# Altium schematic sheet ArduinoUno.SchDoc
size 209 x 148 mm; Organization: LieBtrau; DocumentNumber: 2; SheetNumber: 2; SheetTotal: 2
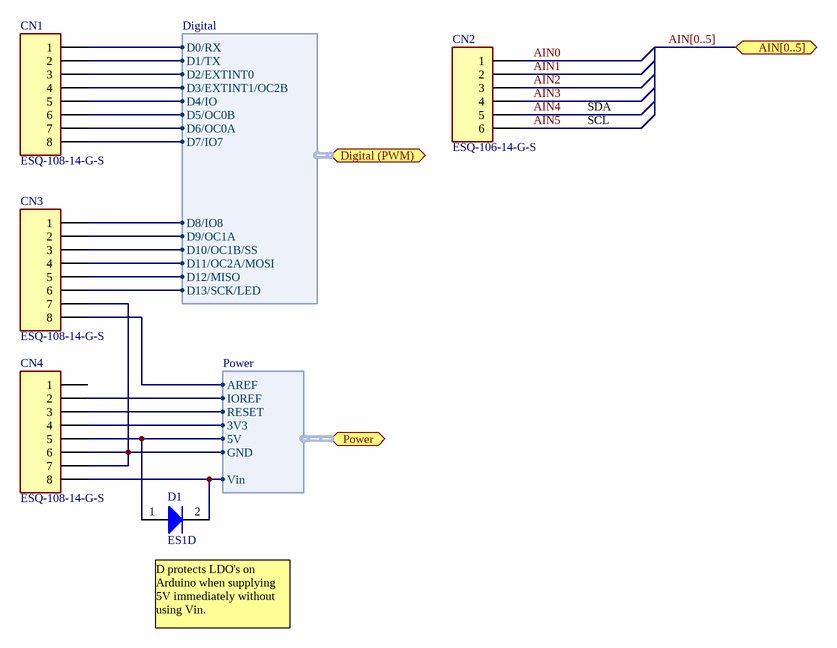
[diagram p0: ArduinoUno.SchDoc]

## Parts
CN1  ESQ-108-14-G-S  [CN_SAMTEC_ESQ-108-14-G-S]
CN2  ESQ-106-14-G-S  [CN_SAMTEC_ESQ-106-14-G-S]
CN3  ESQ-108-14-G-S  [CN_SAMTEC_ESQ-108-14-G-S]
CN4  ESQ-108-14-G-S  [CN_SAMTEC_ESQ-108-14-G-S]
D1  ES1D  [DI_DO-214AC]

## Ports
AIN[0..5], Digital (PWM) (harness Digital), Power (harness Power)

## Harnesses
Power: RESET, 3V3, 5V, GND, Vin, AREF, IOREF
Digital: D0/RX, D1/TX, D2/EXTINT0, D3/EXTINT1/OC2B, D4/IO, D5/OC0B, D6/OC0A, D7/IO7, D9/OC1A, D10/OC1B/SS, D11/OC2A/MOSI, D12/MISO, D13/SCK/LED, D8/IO8

## Nets
AIN0: CN2.1
AIN1: CN2.2
AIN2: CN2.3
AIN3: CN2.4
AIN4: CN2.5
AIN5: CN2.6
NetCN1_1: CN1.1 ; port Digital (PWM).D0/RX
NetCN1_2: CN1.2 ; port Digital (PWM).D1/TX
NetCN1_3: CN1.3 ; port Digital (PWM).D2/EXTINT0
NetCN1_4: CN1.4 ; port Digital (PWM).D3/EXTINT1/OC2B
NetCN1_5: CN1.5 ; port Digital (PWM).D4/IO
NetCN1_6: CN1.6 ; port Digital (PWM).D5/OC0B
NetCN1_7: CN1.7 ; port Digital (PWM).D6/OC0A
NetCN1_8: CN1.8 ; port Digital (PWM).D7/IO7
NetCN3_1: CN3.1 ; port Digital (PWM).D8/IO8
NetCN3_2: CN3.2 ; port Digital (PWM).D9/OC1A
NetCN3_3: CN3.3 ; port Digital (PWM).D10/OC1B/SS
NetCN3_4: CN3.4 ; port Digital (PWM).D11/OC2A/MOSI
NetCN3_5: CN3.5 ; port Digital (PWM).D12/MISO
NetCN3_6: CN3.6 ; port Digital (PWM).D13/SCK/LED
NetCN3_7: CN3.7 CN4.6 CN4.7 ; port Power.GND
NetCN3_8: CN3.8 ; port Power.AREF
NetCN4_2: CN4.2 ; port Power.IOREF
NetCN4_3: CN4.3 ; port Power.RESET
NetCN4_4: CN4.4 ; port Power.3V3
NetCN4_5: CN4.5 D1.1(A) ; port Power.5V
NetCN4_8: CN4.8 D1.2(K) ; port Power.Vin

Not connected (* = marked no-connect by the designer): CN4 1

## Buses and harness runs
bus AIN[0..5] = port AIN[0..5]

## Notes on the sheet
- SDA
- SCL
- (near D1) D protects LDO's on Arduino when supplying 5V immediately without using Vin.
- Title:
- Doc. Name:
- Variant:
- PCB Nr.:
- Rev.:
- Date:
- Drawn by:
- Sheet:
- of

## Library data of the parts
CN1 CN3 CN4 = ESQ-108-14-G-S: *; Manufacturer: Samtec; Order Code: Farnell 1769283; Part Number: ESQ-108-14-G-S; Component Type: connector
CN2 = ESQ-106-14-G-S: *; Manufacturer: Samtec; Order Code: Farnell 1769277; Part Number: ESQ-106-14-G-S; Component Type: connector
D1 = ES1D: 1 Amp General Purpose Rectifier; Manufacturer: Fairchild Semiconductor; Order Code: Farnell 1470967; Part Number: ES1D; Component Type: diode